# EAGLE design freq_meter_final (EAGLE 9.6.2)

## Sheet 1 of 2
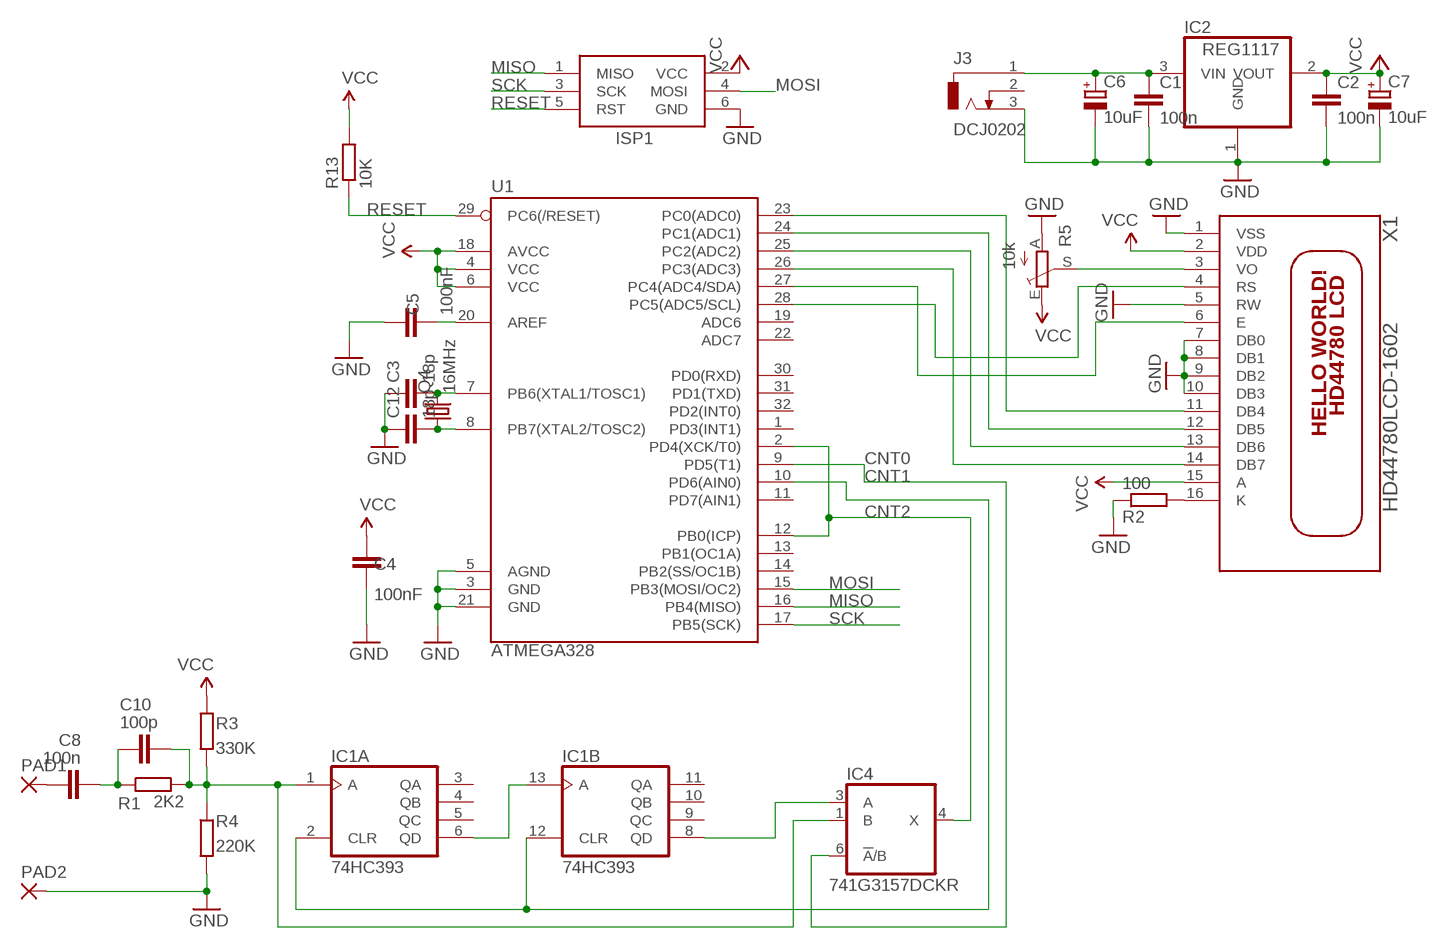
[diagram p0: schematic, sheet 1]

### Parts
C1  100n  C-EUC0805  [C0805]
C2  100n  C-EUC0805  [C0805]
C3  18p  C-EUC0805  [C0805]
C4  100nF  C-EUC0805  [C0805]
C5  100nF  C-EUC0805  [C0805]
C6  10uF  CPOL-EUSMCE  [SMC_E]
C7  10uF  CPOL-EUSMCE  [SMC_E]
C8  100n  C-EUC0805  [C0805]
C10  100p  C-EUC0805  [C0805]
C12  18p  C-EUC0805  [C0805]
IC1  74HC393  74HCT393N  [DIL14]
IC2  REG1117  [SOT223]
IC4  741G3157DCKR  [DCK_R-PDSO-G6]
ISP1  AVRISP-6  [AVRISP]
J3  DCJ0202  [DCJ0202]
PAD1  3,81/1,1  [3,81/1,1]
PAD2  3,81/1,1  [3,81/1,1]
Q4  16MHz  CRYSTALHC49UP  [HC49UP]
R1  2K2  R-EU_R0805  [R0805]
R2  100  R-EU_R0805  [R0805]
R3  330K  R-EU_R0805  [R0805]
R4  220K  R-EU_R0805  [R0805]
R5  10k  TRIM_EU-CA6V  [CA6V]
R13  10K  R-EU_R0805  [R0805]
U1  ATMEGA328  ATMEGA168  [TQFP32-08]
X1  HD44780LCD-1602  [LCD1602]

### Nets
CNT0: IC4.6(!A!/B) U1.9(PD5(T1))
CNT1: IC1.2(A:CLR) IC1.12(B:CLR) U1.10(PD6(AIN0))
CNT2: IC4.4(X) U1.2(PD4(XCK/T0)) U1.12(PB0(ICP))
GND: C1.2 C2.2 C3.1 C4.1 C5.2 C6.- C7.- C12.1 IC2.1(GND) ISP1.6(GND) J3.3 PAD2.1(P) R2.1 R4.2 R5.A U1.3(GND) U1.5(AGND) U1.21(GND) X1.1(VSS) X1.5(RW) X1.7(DB0) X1.8(DB1) X1.9(DB2) X1.10(DB3)
MISO: ISP1.1(MISO) U1.16(PB4(MISO))
MOSI: ISP1.4(MOSI) U1.15(PB3(MOSI/OC2))
N$1: C1.1 C6.+ IC2.3(VIN) J3.1
N$2: R5.S X1.3(VO)
N$3: U1.28(PC5(ADC5/SCL)) X1.4(RS)
N$4: U1.26(PC3(ADC3)) X1.14(DB7)
N$5: U1.25(PC2(ADC2)) X1.13(DB6)
N$6: U1.24(PC1(ADC1)) X1.12(DB5)
N$7: U1.23(PC0(ADC0)) X1.11(DB4)
N$8: U1.27(PC4(ADC4/SDA)) X1.6(E)
N$9: C8.1 PAD1.1(P)
N$10: C10.1 IC1.1(A:A) IC4.1(B) R1.2 R3.1 R4.1
N$11: R2.2 X1.16(K)
N$13: IC1.6(A:QD) IC1.13(B:A)
N$14: IC1.8(B:QD) IC4.3(A)
N$28: C8.2 C10.2 R1.1
N$41: C3.2 Q4.2 U1.7(PB6(XTAL1/TOSC1))
N$42: C12.2 Q4.1 U1.8(PB7(XTAL2/TOSC2))
N$68: C5.1 U1.20(AREF)
RESET: ISP1.5(RST) R13.1 U1.29(PC6(/RESET))
SCK: ISP1.3(SCK) U1.17(PB5(SCK))
VCC: C2.1 C4.2 C7.+ IC2.2(VOUT) ISP1.2(VCC) R3.2 R5.E R13.2 U1.4(VCC) U1.6(VCC) U1.18(AVCC) X1.2(VDD) X1.15(A)
Unconnected: IC1.3(A:QA) IC1.4(A:QB) IC1.5(A:QC) IC1.9(B:QC) IC1.10(B:QB) IC1.11(B:QA) J3.2 U1.1(PD3(INT1)) U1.11(PD7(AIN1)) U1.13(PB1(OC1A)) U1.14(PB2(SS/OC1B)) U1.19(ADC6) U1.22(ADC7) U1.30(PD0(RXD)) U1.31(PD1(TXD)) U1.32(PD2(INT0))

## Sheet 2 of 2

## Power pins joined to a net without a drawn wire
GND: IC1.7(P:GND) IC4.2(GND)
VCC: IC1.14(P:VCC) IC4.5(VCC)

## Library data of the parts
C1 C2 C8 C10 = rcl:C-EU: CAPACITOR, European symbol; SPICEPREFIX: C
C3 C12 = rcl:C-EU: CAPACITOR, European symbol
C4 C5 = resistor:C-EU: CAPACITOR, European symbol
C6 C7 = rcl:CPOL-EU: POLARIZED CAPACITOR, European symbol; SPICEPREFIX: C
IC1 = 74xx-eu:74*393: Dual 4-bit decade and binary COUNTER
IC2 = burr-brown:REG1117: 800mA and 1A Low Dropout (LDO) Positive Regulator 1.8V, 2.5V, 2.85V, 3.3V, 5V, and Adj; MPN: REG1117; OC_FARNELL: 1097566; OC_NEWARK: 14P6981
IC4 = 74xx-little-de:74*1G3157: Single-Pole, Double-Throw Analog Switch Source: http://focus.ti.com/lit/ds/symlink/sn74lvc1g3157.pdf
ISP1 = adafruit:AVRISP: AVR ISP HEADER Standard 6 pin header for AVR programming
J3 = con-jack-igi:DCJ0202: DC POWER JACK Source: DCJ0202.pdf; OC_FARNELL: unknown; OC_NEWARK: unknown
PAD1 PAD2 = wirepad:3,81/1,1: THROUGH-HOLE PAD
Q4 = crystal:CRYSTAL: CRYSTAL; OC_FARNELL: unknown; OC_NEWARK: unknown
R1 R3 R4 = rcl:R-EU_: RESISTOR, European symbol; SPICEPREFIX: R
R2 R13 = resistor:R-EU_: RESISTOR, European symbol
R5 = pot:TRIM_EU-: POTENTIOMETER
U1 = SparkFun:ATMEGA168
X1 = adafruit:HD44780LCD: HD44780 LCD Standard character type LCDs, available in sizes from 8x1 to 40x4!

## Net classes
1 vcc: width 0.254 mm

## Board
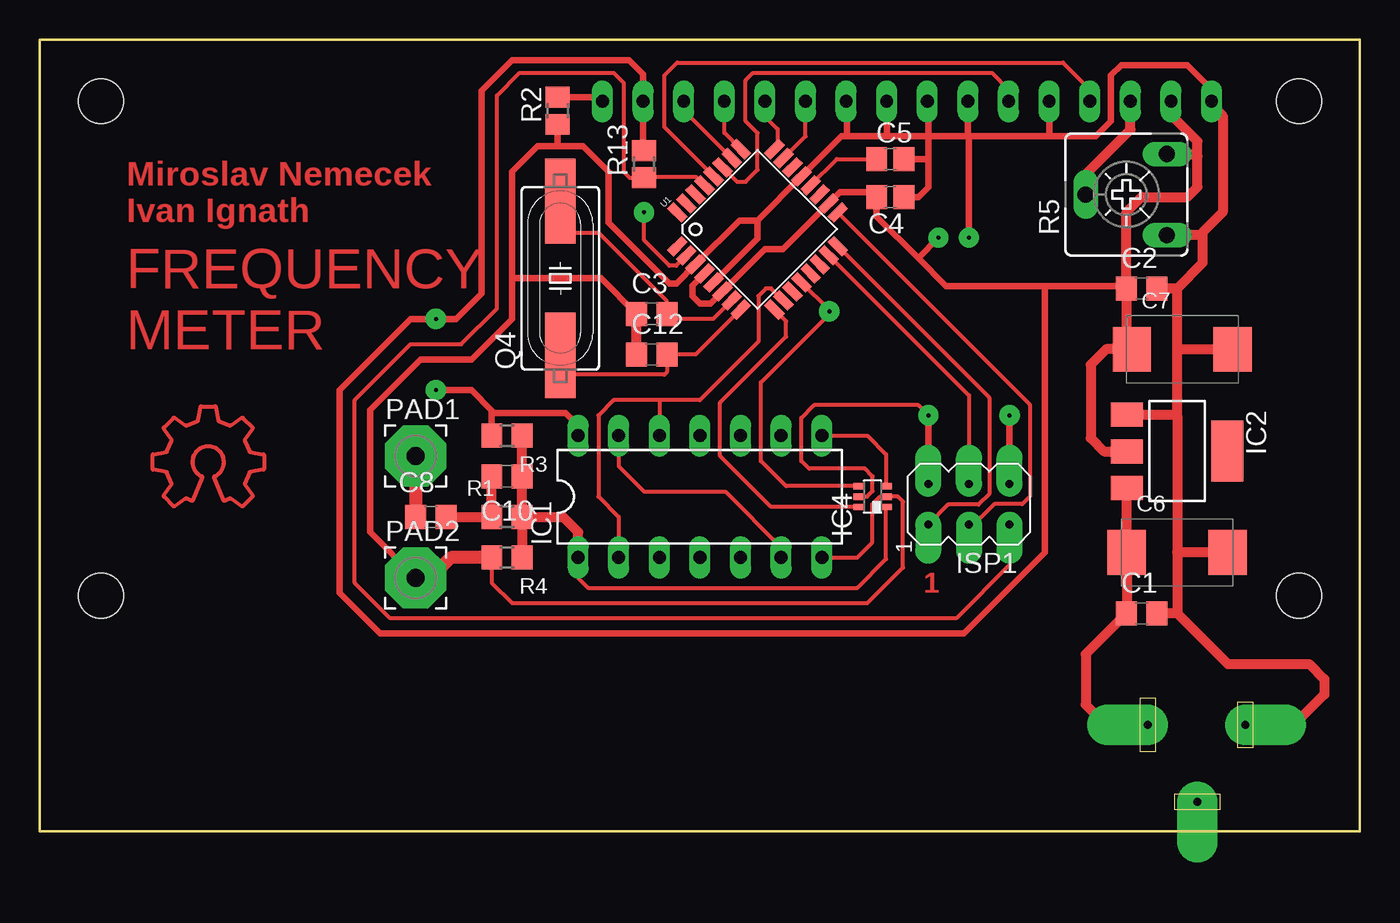
[diagram p1: board, top side]
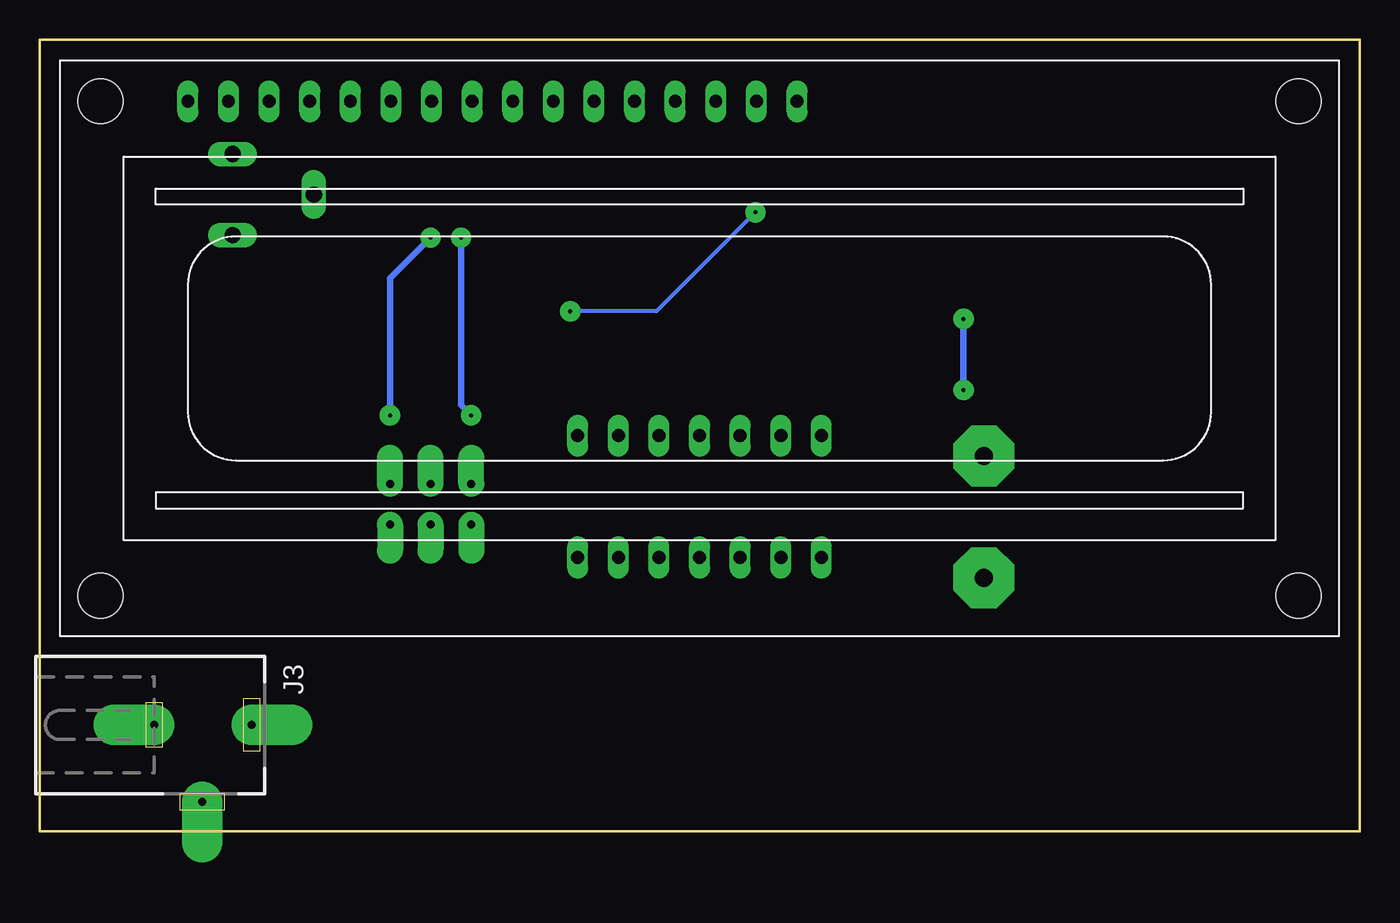
[diagram p2: board, bottom side, seen from below]

Size 82.53 x 49.52 mm. Coordinates in mm from the lower left corner, seen from the top.
Outline: 0,0 82.53,0 82.53,49.52 0,49.52 0,0
Copper layers (1*16): Top 0.035mm / dielectric 1.5mm / Bottom 0.035mm
Design rules "default": minimum track width 10mil, minimum drill 24mil, track to track 8mil, track to pad 8mil, pad to pad 8mil, via to via 8mil, smd to smd 8mil, copper to edge 40mil, drill to drill 8mil, minimum pad ring 10mil, minimum via ring 8mil, stop-mask expansion 4mil, vias tented up to drill 0mil, thermal gap 10mil

### Footprints (pad centres in the part's own frame; a part is rotated, then mirrored left to right if it is on the bottom)
C0805 = smd 1.3 x 1.5: 1 -0.95,0; 2 0.95,0
C0805' = smd 1.3 x 1.5: 1 -0.85,0; 2 0.85,0
SMC_E = smd 2.4 x 2.8: + -3.15,0; - 3.15,0
DIL14 = drill 0.813 long: 1 -7.62,-3.81; 2 -5.08,-3.81; 3 -2.54,-3.81; 4 0,-3.81; 5 2.54,-3.81; 6 5.08,-3.81; 7 7.62,-3.81; 8 7.62,3.81; 9 5.08,3.81; 10 2.54,3.81; 11 0,3.81; 12 -2.54,3.81; 13 -5.08,3.81; 14 -7.62,3.81
SOT223 = smd 1.499 x 2.007: 1 -2.261,-3.15; 2 0.025,-3.15; 3 2.311,-3.15 | smd 3.81 x 2.007: 4 0,3.15
DCK_R-PDSO-G6 = smd 0.4 x 0.7: 1 -0.65,-0.85; 2 0,-0.85; 3 0.65,-0.85; 4 0.65,0.85; 5 0,0.85; 6 -0.65,0.85
AVRISP = drill 0.508 pad 1.626 offset: 1 -1.27,2.54; 2 1.27,2.54; 3 -1.27,0; 4 1.27,0; 5 -1.27,-2.54; 6 1.27,-2.54
DCJ0202 = drill 0.508 pad 2.54 offset: 1 0,3.1; 2 4.8,0; 3 0,-3
3,81/1,1 = drill 1.118 pad 3.81 octagon: 1 0,0
HC49UP = smd 5.334 x 1.93: 1 -4.826,0; 2 4.826,0
R0805 = smd 1.3 x 1.5: 1 -0.95,0; 2 0.95,0
R0805' = smd 1.3 x 1.5: 1 -0.85,0; 2 0.85,0
CA6V = drill 1.016 long: A -2.54,-2.54; E 2.54,-2.54; S 0,2.54
TQFP32-08 = smd 1.27 x 0.559: 1 -4.293,2.8; 2 -4.293,2; 3 -4.293,1.2; 4 -4.293,0.4; 5 -4.293,-0.4; 6 -4.293,-1.2; 7 -4.293,-2; 8 -4.293,-2.8; 17 4.293,-2.8; 18 4.293,-2; 19 4.293,-1.2; 20 4.293,-0.4; 21 4.293,0.4; 22 4.293,1.2; 23 4.293,2; 24 4.293,2.8 | smd 0.559 x 1.27: 9 -2.8,-4.293; 10 -2,-4.293; 11 -1.2,-4.293; 12 -0.4,-4.293; 13 0.4,-4.293; 14 1.2,-4.293; 15 2,-4.293; 16 2.8,-4.293; 25 2.8,4.293; 26 2,4.293; 27 1.2,4.293; 28 0.4,4.293; 29 -0.4,4.293; 30 -1.2,4.293; 31 -2,4.293; 32 -2.8,4.293
LCD1602 = drill 0.8 long: 1 8,33.46; 2 10.54,33.46; 3 13.08,33.46; 4 15.62,33.46; 5 18.16,33.46; 6 20.7,33.46; 7 23.24,33.46; 8 25.78,33.46; 9 28.32,33.46; 10 30.86,33.46; 11 33.4,33.46; 12 35.94,33.46; 13 38.48,33.46; 14 41.02,33.46; 15 43.56,33.46; 16 46.1,33.46 | hole 2.8: 2.54,2.54; 2.54,33.46; 77.46,33.46; 77.46,2.54

### Placement (x,y rotation side)
C1  68.9,13.65 0 top
C2  68.9,33.97 0 top
C3  38.26,32.38 0 top
C4  100nF  [C0805']  53.18,39.69 180 top
C5  100nF  [C0805']  53.18,42.07 0 top
C6  71.12,17.46 0 top
C7  71.44,30.16 0 top
C8  24.45,19.68 0 top
C10  29.21,22.23 180 top
C12  38.26,29.84 0 top
IC1  41.27,20.95 0 top
IC2  71.12,23.81 270 top
IC4  52.07,20.95 90 top
ISP1  58.1,20.48 90 top
J3  72.39,6.67 270 bottom
PAD1  23.5,23.5 0 top
PAD2  23.5,15.88 0 top
Q4  32.54,34.61 90 top
R1  29.21,19.68 0 top
R2  100  [R0805']  32.38,45.09 90 top
R3  29.21,24.77 180 top
R4  29.21,17.14 180 top
R5  67.94,39.85 90 top
R13  10K  [R0805']  37.78,41.75 90 top
U1  44.88,37.67 45 top
X1  81.28,12.22 0 bottom

### Tracks (layer width: path | path; a pad name or v marks a point on that pad's centre or on a via)
CNT0
  Top 0.254: IC4.6 45.73,20.3 42.55,23.5 42.55,26.83 46.67,30.96 46.67,31.92 U1.9
CNT1
  Top 0.254: U1.10 46.47,33.22 45.72,33.97 45.4,33.97 44.93,33.5 44.93,30.64 41.27,26.99 38.73,26.99 | 38.73,26.99 IC1.12 | 38.73,26.99 35.88,26.99 34.92,26.04 34.92,20.95 36.2,19.68 IC1.2
CNT2  (via drill 0.25 pad 1.27)
  Top 0.254: IC4.4 46.66,21.61 45.09,23.18 45.09,28.1 49.37,32.38 v49.37,32.54 49.37,32.61 U1.12 | U1.2 39.78,35.4 39.37,35.4 37.78,36.99 v37.78,38.73
  Bottom 0.254: v37.78,38.73 43.97,32.54 v49.37,32.54
GND  (via drill 0.25 pad 1.27)
  Top 0.254: IC1.7 51.12,17.14 52.06,18.09 52.06,20.48 52.53,20.95 IC4.2 53.66,20.95 53.98,20.64 53.98,16.51 51.75,14.29 29.53,14.29 28.26,15.55 R4.2
  Top 0.406: 44.88,38.23 U1.21 50.14,43.5 50.48,43.5 | U1.5 44.88,37.1 44.88,38.23 | 44.88,38.23 43.74,38.23 U1.3 | 63.12,43.5 X1.5 | 50.48,43.5 53.02,43.5 | 53.02,43.5 55.56,43.5 | 63.12,43.5 66.04,43.5 66.99,44.45 66.99,47.31 67.63,47.94 71.75,47.94 73.28,46.42 X1.1 | 55.56,43.5 58.1,43.5 | 58.1,43.5 63.12,43.5 | 32.38,42.86 31.11,42.86 29.53,41.27 29.53,34.61 | 32.38,42.86 33.97,42.86 35.56,41.27 35.56,38.1 39.37,34.29 39.8,34.29 U1.3 | R2.1 32.38,42.86 | U1.3 | 29.53,34.61 35.09,34.61 C3.1 | 29.53,34.61 29.53,32.07 26.99,29.53 23.81,29.53 20.64,26.35 20.64,18.73 PAD2.1 | X1.8 55.56,45.62 55.56,43.5 | X1.10 50.48,45.62 50.48,43.5 | X1.9 52.96,43.56 53.02,43.5 | X1.7 58.04,43.56 58.1,43.5 | 55.56,43.5 55.56,42.07 | 55.56,42.07 55.56,40.32 54.93,39.69 C4.1 | ISP1.6 v60.64,26.04 | v58.1,37.15 58.1,43.5 | C5.2 55.56,42.07
  Top 0.61: IC2.1 71.08,26.07 | 71.08,26.07 71.12,26.04 71.12,17.46 | C6.- 71.12,17.46 | 71.08,26.07 71.12,26.11 71.12,30.16 | C7.- 71.12,30.16 | 71.12,30.16 71.12,33.97 | 71.12,33.97 C2.2 | 71.12,17.46 71.12,13.65 | 71.12,13.65 C1.2 | J3.3 78.42,6.67 80.33,8.57 80.33,9.53 79.38,10.48 74.3,10.48 71.12,13.65 | C12.1 C3.1 | X1.1 73.34,45.62 73.34,45.4 73.98,44.77 73.98,38.73 72.71,37.47 72.71,37.31 | 72.71,37.31 72.71,35.56 71.12,33.97 | 72.71,37.31 R5.A
  Top 0.813: PAD2.1 24.45,15.88 25.72,17.14 R4.2
  Bottom 0.406: v58.1,37.15 60.64,34.61 v60.64,26.04
MISO
  Top 0.254: U1.16 59.37,27.14 59.37,21.11 58.71,20.45 56.8,20.45 ISP1.1
MOSI
  Top 0.254: U1.15 58.1,27.28 ISP1.4
N$1
  Top 0.406: IC2.3
  Top 0.61: J3.1 66.67,6.67 65.41,7.94 65.41,11.11 C1.1 67.97,13.68 C6.+ IC2.3
N$2
  Top 0.61: R5.S 65.41,41.12 68.2,43.91 X1.3
N$3
  Top 0.254: U1.28 39.05,44.06 39.05,47.31 39.85,48.1 63.98,48.1 65.66,46.42 X1.4
N$4
  Top 0.254: U1.26 40.26,45.12 X1.14
N$5
  Top 0.254: U1.25 42.8,43.71 X1.13
N$6
  Top 0.254: U1.24 45.94,42.77 46.13,42.96 46.13,43.94 45.34,44.73 X1.12
N$7
  Top 0.254: U1.23 47.88,43.5 X1.11
N$8
  Top 0.254: U1.27 43.61,40.64 44.13,40.64 44.88,41.39 44.88,43.7 44.13,44.45 44.13,46.99 44.61,47.47 59.53,47.47 60.58,46.42 X1.6
N$9
  Top 0.813: PAD1.1 C8.1
N$10
  Top 0.254: IC1.1 33.66,15.88 34.29,15.24 51.12,15.24 52.92,17.04 IC4.1
  Top 0.61: R1.2 R4.1 | R1.2 C10.1 R3.1 | R1.2 32.7,19.68 33.66,18.73 IC1.1
N$11
  Top 0.406: R2.2 34.93,45.94 X1.16
N$13
  Top 0.254: IC1.13 36.2,22.86 37.78,21.27 42.86,21.27 46.35,17.78 IC1.6
N$14
  Top 0.254: IC1.8 51.75,24.77 52.92,23.6 IC4.3
N$27
  Top 0.01: 7.07,22.65 arc-79 7.04,22.69 | 7.04,23.54 arc-79 7.07,23.59
  Top 0.254: 7.07,22.65 7.91,22.48 arc-57 7.94,22.46 8.23,21.76 arc-57 8.23,21.71 7.75,21.01 arc79 7.75,20.95 8.36,20.35 arc79 8.41,20.34 9.12,20.82 arc-57 9.16,20.83 9.48,20.69 arc90 9.54,20.72 10.13,22.16 arc88 10.11,22.22 arc-311 10.93,22.22 arc88 10.91,22.16 11.5,20.72 arc90 11.56,20.69 11.88,20.83 arc-57 11.92,20.82 12.63,20.34 arc79 12.68,20.35 13.29,20.95 arc79 13.29,21.01 12.81,21.71 arc-57 12.81,21.76 13.1,22.46 arc-57 13.13,22.48 13.97,22.65 arc79 14.01,22.69 14.01,23.54 arc79 13.97,23.59 13.13,23.75 arc-57 13.1,23.77 12.81,24.48 arc-57 12.81,24.52 13.29,25.22 arc79 13.29,25.28 12.68,25.88 arc79 12.63,25.89 11.92,25.41 arc-57 11.88,25.41 11.18,25.7 arc-57 11.15,25.73 10.99,26.57 arc79 10.95,26.6 10.1,26.6 arc79 10.05,26.57 9.89,25.73 arc-57 9.86,25.7 9.16,25.41 arc-57 9.12,25.41 8.41,25.89 arc79 8.36,25.88 7.75,25.28 arc79 7.75,25.22 8.23,24.52 arc-57 8.23,24.48 7.94,23.77 arc-57 7.91,23.75 7.07,23.59 | 7.04,22.69 7.04,23.54
N$28
  Top 0.61: C8.2 R1.1 C10.2
N$41
  Top 0.254: U1.7 42.1,32.07 39.53,32.07 C3.2 39.21,33.18 34.92,37.47 32.38,37.47
  Top 0.406: Q4.2 32.54,37.62 32.38,37.47
N$42
  Top 0.254: U1.8 41.01,29.84 C12.2 39.21,28.73 39.05,28.57 32.38,28.57 32.38,29.62 Q4.1
N$68
  Top 0.254: U1.20 49.84,42.07 C5.1
RESET
  Top 0.254: ISP1.5 60.64,16.67 57.31,13.34 21.91,13.34 19.68,15.56 19.68,26.99 23.18,30.48 26.35,30.48 28.57,32.7 28.57,46.04 30,47.47 35.88,47.47 36.51,46.83 36.51,41.27 36.89,40.9 R13.1 37.84,40.96 41.03,40.96 U1.29
SCK
  Top 0.254: ISP1.3 58.42,19.21 59.69,20.48 61.44,20.48 61.91,20.95 61.91,26.71 U1.17
VCC  (via drill 0.25 pad 1.27)
  Top 0.254: IC4.5 51.73,20.95 52.07,21.3 52.07,22.23 51.59,22.7 48.1,22.7 47.62,23.18 47.62,25.88 48.42,26.67 54.93,26.67 v55.56,26.04
  Top 0.406: R13.2 37.72,42.66 X1.15 37.72,47.37 36.83,48.26 29.53,48.26 27.62,46.35 27.62,33.66 26.04,32.07 v24.77,32.07 23.18,32.07 18.73,27.62 18.73,14.92 21.27,12.38 57.78,12.38 62.87,17.46 62.87,34.13 | 54.93,35.88 52.33,38.47 C4.2 52.01,40.01 50.04,40.01 U1.18 46.47,36.44 45.34,36.44 U1.6 41.93,33.02 41.27,33.02 40.8,33.5 40.8,34.16 U1.4 | 54.93,35.88 56.67,34.13 62.87,34.13 | v24.77,27.62 26.99,27.62 28.26,26.35 | 28.26,26.35 28.42,26.19 32.86,26.19 33.66,25.4 IC1.14 | R3.2 28.26,26.35 | 62.87,34.13 67.95,34.13 | ISP1.2 v55.56,26.04 | v56.2,37.15 54.93,35.88
  Top 0.61: 68.28,30.18 67.95,30.5 C2.1 67.95,34.13 67.95,38.74 68.9,39.69 71.75,39.69 72.39,40.32 72.39,42.23 | 68.28,30.18 C7.+ | 68.28,30.18 66.69,30.18 65.72,29.21 65.72,24.61 66.54,23.79 IC2.2 | 72.39,42.23 72.39,43.18 70.74,44.83 X1.2 | R5.E 72.23,42.39 72.39,42.23
  Bottom 0.406: v24.77,32.07 v24.77,27.62 | v55.56,26.04 56.2,26.67 v56.2,37.15

### Text on the board
Top: Miroslav Nemecek / Ivan Ignath | FREQUENCY / METER | 1